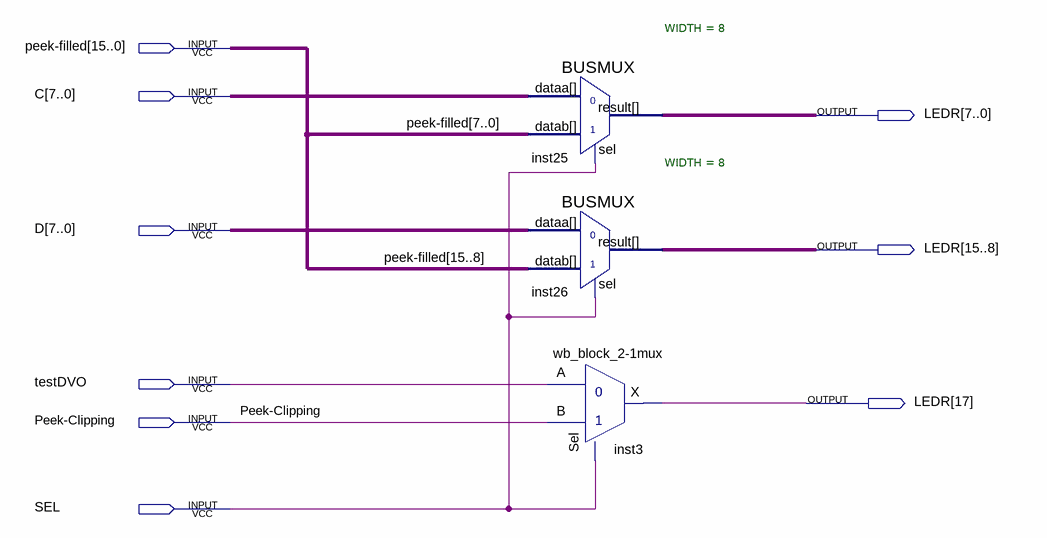
[diagram p0: schematic sheet]
// Quartus schematic wb_signal_LEDRmux.bdf as structural Verilog: 3 symbols, 9 pins
module wb_signal_LEDRmux (
  input  [15:0] \peek-filled ,
  input  [7:0] C,
  input  [7:0] D,
  input  testDVO,
  input  \Peek-Clipping ,
  input  SEL,
  output [17:0] LEDR
);

  BUSMUX #(.WIDTH(8)) inst25 (.datab(\peek-filled [7:0]), .sel(SEL), .dataa(C), .result(LEDR[7:0]));
  BUSMUX #(.WIDTH(8)) inst26 (.datab(\peek-filled [15:8]), .sel(SEL), .dataa(D), .result(LEDR[15:8]));
  \wb_block_2-1mux  inst3 (.A(testDVO), .Sel(SEL), .B(\Peek-Clipping ), .X(LEDR[17]));
endmodule
